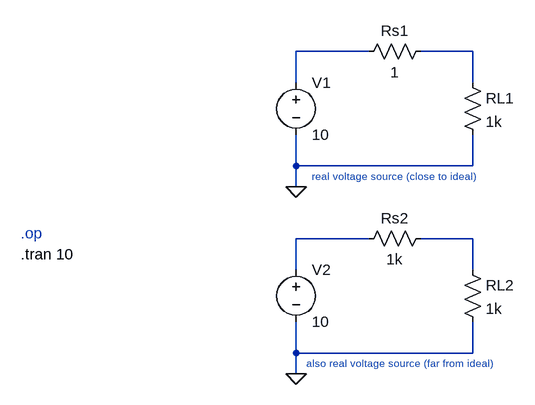
[diagram p0: schematic circuit.asc]
circuit.asc, the LTspice schematic file:
Version 4.1
SHEET 1 880 680
WIRE 144 64 32 64
WIRE 304 64 224 64
WIRE 32 112 32 64
WIRE 304 112 304 64
WIRE 32 240 32 192
WIRE 304 240 304 192
WIRE 304 240 32 240
WIRE 32 272 32 240
WIRE 144 352 32 352
WIRE 304 352 224 352
WIRE 32 400 32 352
WIRE 304 400 304 352
WIRE 32 528 32 480
WIRE 304 528 304 480
WIRE 304 528 32 528
WIRE 32 560 32 528
FLAG 32 272 0
FLAG 32 560 0
DATAFLAG 304 64 ""
DATAFLAG 32 64 ""
DATAFLAG 304 352 ""
DATAFLAG 32 352 ""
SYMBOL voltage 32 96 R0
WINDOW 123 0 0 Left 0
WINDOW 39 0 0 Left 0
SYMATTR InstName V1
SYMATTR Value 10
SYMBOL res 240 48 R90
WINDOW 0 0 56 VBottom 2
WINDOW 3 32 56 VTop 2
SYMATTR InstName Rs1
SYMATTR Value 1
SYMBOL res 288 96 R0
SYMATTR InstName RL1
SYMATTR Value 1k
SYMBOL voltage 32 384 R0
WINDOW 123 0 0 Left 0
WINDOW 39 0 0 Left 0
SYMATTR InstName V2
SYMATTR Value 10
SYMBOL res 240 336 R90
WINDOW 0 0 56 VBottom 2
WINDOW 3 32 56 VTop 2
SYMATTR InstName Rs2
SYMATTR Value 1k
SYMBOL res 288 384 R0
SYMATTR InstName RL2
SYMATTR Value 1k
TEXT -392 344 Left 2 ;.op
TEXT 56 256 Left 1 ;real voltage source (close to ideal)
TEXT 48 544 Left 1 ;also real voltage source (far from ideal)
TEXT -392 376 Left 2 !.tran 10

The netlist it stands for:
* circuit.asc
V1 N001 0 10
Rs1 N002 N001 1
RL1 N002 0 1k
V2 N003 0 10
Rs2 N004 N003 1k
RL2 N004 0 1k
* .op
* real voltage source (close to ideal)
* also real voltage source (far from ideal)
.tran 10
.backanno
.end